# EAGLE design e-stop-radio (EAGLE 9.6.2)

## Sheet 1 of 2
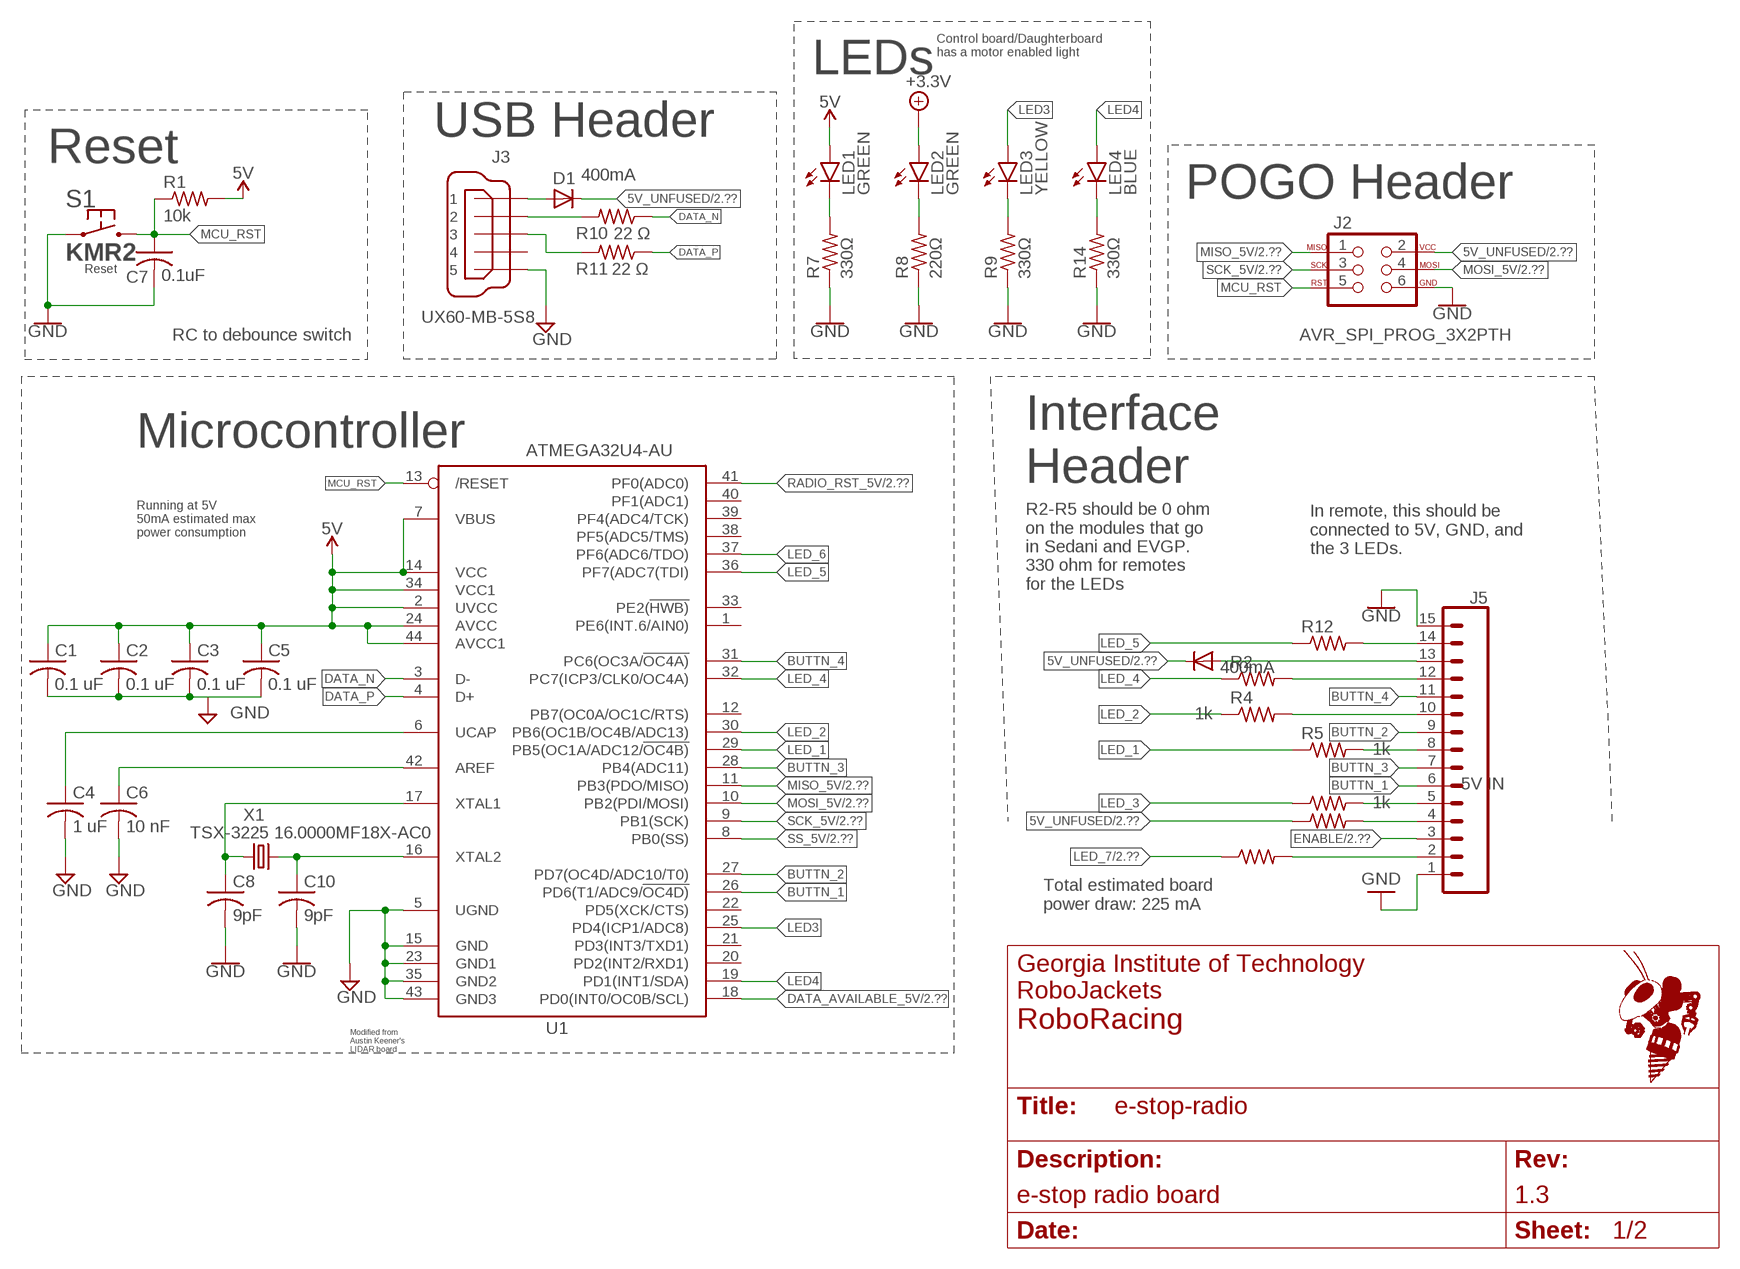
[diagram p0: schematic, sheet 1]
FRAME4 (FRAME_A_L): REVISION: 1.3; SCH_DESC: e-stop radio board; TEAM: RoboRacing

### Parts
C1  0.1 uF  C-USC0603  [C0603]
C2  0.1 uF  C-USC0603  [C0603]
C3  0.1 uF  C-USC0603  [C0603]
C4  1 uF  C-USC0603  [C0603]
C5  0.1 uF  C-USC0603  [C0603]
C6  10 nF  C-USC0603  [C0603]
C7  0.1uF  C-USC0603  [C0603]
C8  9pF  C-USC0603  [C0603]
C10  9pF  C-USC0603  [C0603]
D1  400mA  DIODE-SOD323-R  [SOD323-R]
D4  400mA  DIODE-SOD323-R  [SOD323-R]
J2  AVR_SPI_PROG_3X2PTH  [2X3]
J3  UX60-MB-5S8  [UX60-MB-5S8]
J5  CONN_15  [1X15]
LED1  GREEN  LEDCHIP-LED0603  [CHIP-LED0603]
LED2  GREEN  LEDCHIP-LED0603  [CHIP-LED0603]
LED3  YELLOW  LEDCHIP-LED0603  [CHIP-LED0603]
LED4  BLUE  LEDCHIP-LED0603  [CHIP-LED0603]
R1  10k  R-US_R0603  [R0603]
R2  330  R-US_R0603  [R0603]
R3\  1k  R-US_R0603  [R0603]
R4  1k  R-US_R0603  [R0603]
R5  1k  R-US_R0603  [R0603]
R7  330Ω  R-US_R0603  [R0603]
R8  220Ω  R-US_R0603  [R0603]
R9  330Ω  R-US_R0603  [R0603]
R10  22 Ω  R-US_R0603  [R0603]
R11  22 Ω  R-US_R0603  [R0603]
R12  330  R-US_R0603  [R0603]
R14  330Ω  R-US_R0603  [R0603]
R17  330  R-US_R0603  [R0603]
R18  330  R-US_R0603  [R0603]
S1  KMR2  [KMR2]
U1  ATMEGA32U4-AU  [TQFP44]
X1  TSX-3225 16.0000MF18X-AC0  XTAL-3.2X2.5  [XTAL-3.2X2.5]

### Nets
5V [power]: C1.1 C2.1 C3.1 C5.1 LED1.A R1.2 U1.2(UVCC) U1.7(VBUS) U1.14(VCC) U1.24(AVCC) U1.34(VCC1) U1.44(AVCC1) ; also sheet 2
5V_UNFUSED [power]: D1.C D4.C J2.2 R17.1 ; also sheet 2
+3.3V [power]: LED2.A ; also sheet 2
AREF: C6.1 U1.42(AREF)
BUTTN_1: J5.6 U1.26(PD6(T1/ADC9/!OC4D))
BUTTN_2: J5.9 U1.27(PD7(OC4D/ADC10/T0))
BUTTN_3: J5.7 U1.28(PB4(ADC11))
BUTTN_4: J5.11 U1.31(PC6(OC3A/!OC4A))
DATA_AVAILABLE_5V: U1.18(PD0(INT0/OC0B/SCL)) ; also sheet 2
DATA_N [RF]: R10.1 U1.3(D-)
DATA_P [RF]: R11.1 U1.4(D+)
DIO_4_R: J5.8 R5.2
DIO_5_R: J5.10 R4.2
DIO_6_R: J5.5 R3\.2
DIO_7_R: J5.12 R2.2
DIO_7_R1: J5.14 R12.2
DIO_7_R2: J5.4 R17.2
DIO_7_R3: J5.2 R18.2
ENABLE: J5.3 ; also sheet 2
GND [power]: C1.2 C2.2 C3.2 C4.2 C5.2 C6.2 C7.2 C8.2 C10.2 J2.6 J3.5 J5.15 R7.1 R8.1 R9.1 R14.1 S1.1.1 S1.1.2 U1.5(UGND) U1.15(GND) U1.23(GND1) U1.35(GND2) U1.43(GND3) ; also sheet 2
H4 [power]: D4.A J5.13
LED3: LED3.A U1.25(PD4(ICP1/ADC8))
LED4: LED4.A U1.19(PD1(INT1/SDA))
LED_1: R5.1 U1.29(PB5(OC1A/ADC12/!OC4B))
LED_2: R4.1 U1.30(PB6(OC1B/OC4B/ADC13))
LED_3: R3\.1
LED_4: R2.1 U1.32(PC7(ICP3/CLK0/OC4A))
LED_5: R12.1 U1.36(PF7(ADC7(TDI))
LED_6: U1.37(PF6(ADC6/TDO))
LED_7: R18.1 ; also sheet 2
MCU_RST: C7.1 J2.5 R1.1 S1.2.1 S1.2.2 U1.13(/RESET)
MISO_5V: J2.1 U1.11(PB3(PDO/MISO)) ; also sheet 2
MOSI_5V: J2.4 U1.10(PB2(PDI/MOSI)) ; also sheet 2
N$2: LED3.C R9.2
N$3: LED1.C R7.2
N$4: LED2.C R8.2
N$5: J3.2 R10.2
N$6: LED4.C R14.2
N$7: D1.A J3.1
N$11: J3.3 R11.2
N$15: J5.1 ; supply symbol labelled GND
RADIO_RST_5V: U1.41(PF0(ADC0)) ; also sheet 2
SCK_5V: J2.3 U1.9(PB1(SCK)) ; also sheet 2
SS_5V: U1.8(PB0(SS)) ; also sheet 2
UCAP: C4.1 U1.6(UCAP)
XTAL1: C8.1 U1.17(XTAL1) X1.1
XTAL2: C10.1 U1.16(XTAL2) X1.3
Unconnected: J3.4 U1.1(PE6(INT.6/AIN0)) U1.12(PB7(OC0A/OC1C/RTS)) U1.20(PD2(INT2/RXD1)) U1.21(PD3(INT3/TXD1)) U1.22(PD5(XCK/CTS)) U1.33(PE2(!HWB)) U1.38(PF5(ADC5/TMS)) U1.39(PF4(ADC4/TCK)) U1.40(PF1(ADC1))

### Notes on the sheet
- Control board/Daughterboard
  has a motor enabled light
- LEDs
- USB Header
- Reset
- POGO Header
- RC to debounce switch
- Microcontroller
- Interface
  Header
- Running at 5V
  50mA estimated max
  power consumption
- In remote, this should be 
  connected to 5V, GND, and 
  the 3 LEDs.
- R2-R5 should be 0 ohm
  on the modules that go
  in Sedani and EVGP.
  330 ohm for remotes
  for the LEDs
- 5V IN
- Total estimated board
  power draw: 225 mA
- Modified from 
  Austin Keener's 
  LIDAR board

## Sheet 2 of 2
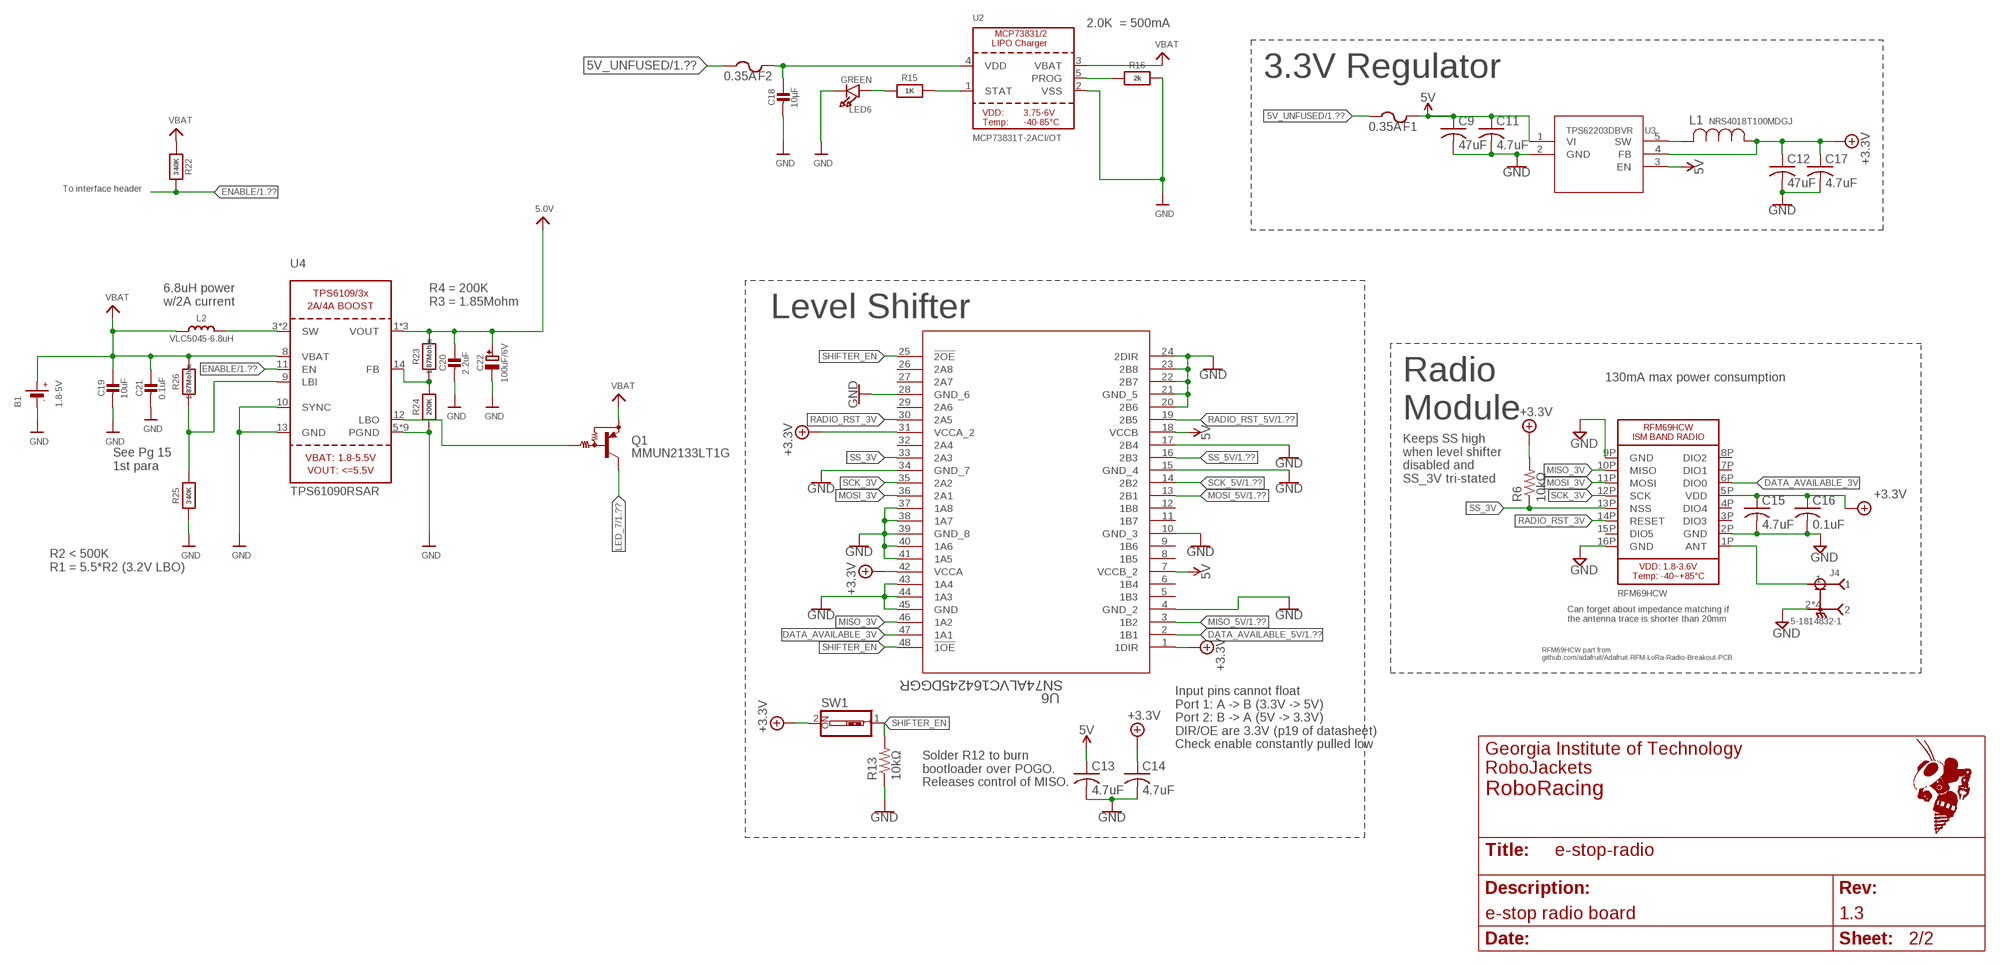
[diagram p1: schematic, sheet 2]
FRAME3 (FRAME_A_L): REVISION: 1.3; SCH_DESC: e-stop radio board; TEAM: RoboRacing

### Parts
B1  1.8-5V  BATTERY  [JSTPH2]
C9  47uF  C-USC1206  [C1206]
C11  4.7uF  C-USC0603  [C0603]
C12  47uF  C-USC1206  [C1206]
C13  4.7uF  C-USC0603  [C0603]
C14  4.7uF  C-USC0603  [C0603]
C15  4.7uF  C-USC0603  [C0603]
C16  0.1uF  C-USC0603  [C0603]
C17  4.7uF  C-USC0603  [C0603]
C18  10µF  CAP_CERAMIC0805-NOOUTLINE  [0805-NO]
C19  10uF  CAP_CERAMIC0805-NOOUTLINE  [0805-NO]
C20  2.2uF  CAP_CERAMIC0805-NOOUTLINE  [0805-NO]
C21  0.1uF  CAP_CERAMIC0805-NOOUTLINE  [0805-NO]
C22  100uF/6V  CAP_TANTALUMB/3528_REFLOW  [EIA3528-21/B-R]
F1  0.35A  PTCFUSE-1206  [R1206]
F2  0.35A  PTCFUSE-1206  [R1206]
J4  5-1814832-1  [TE_5-1814832-1]
L1  NRS4018T100MDGJ  [IND_TAIYO_NRS4018]
L2  VLC5045-6.8uH  INDUCTORTDK_VLC5045  [INDUCTOR_5X5MM_TDK_VLC5045]
LED6  GREEN  LED0805_NOOUTLINE  [CHIPLED_0805_NOOUTLINE]
Q1  MMUN2133LT1G  MUN2114T1-PNP_DRIVER-SC59-BEC  [SC59-BEC]
R6  10kΩ  R-US_R0603  [R0603]
R13  10kΩ  R-US_R0603  [R0603]
R15  1K  RESISTOR0805_NOOUTLINE  [0805-NO]
R16  2k  RESISTOR0805_NOOUTLINE  [0805-NO]
R22  340K  RESISTOR0805_NOOUTLINE  [0805-NO]
R23  1.87Mohm  RESISTOR0805_NOOUTLINE  [0805-NO]
R24  200K  RESISTOR0805_NOOUTLINE  [0805-NO]
R25  340K  RESISTOR0805_NOOUTLINE  [0805-NO]
R26  1.87Mohm  RESISTOR0805_NOOUTLINE  [0805-NO]
SW1  SW_DIP-1  [EDG-01]
U2  MCP73831T-2ACI/OT  MCP73831/2  [SOT23-5]
U3  TPS62203DBVR  [DBV5]
U4  TPS61090RSAR  VREG_TPS6103X  [PVQFN-16]
U5  RFM69HCW  RFM69HCW_SMT  [RFMHCW_SMT]
U6  SN74ALVC164245DGGR  [DGG48]

### Nets
5V [power]: C9.1 C11.1 C13.1 C20.1 C22.+ F1.2 R23.2 U3.1(VI) U3.3(EN) U4.1(VOUT) U4.15(VOUT) U4.16(VOUT) U6.7(VCCB_2) U6.18(VCCB) ; supply symbol labelled 5.0V ; also sheet 1
5V_UNFUSED [power]: F1.1 F2.1 ; also sheet 1
+3.3V [power]: C12.1 C14.1 C15.1 C16.1 C17.1 L1.1 R6.2 SW1.2 U3.4(FB) U5.5P(VDD) U6.1(1DIR) U6.31(VCCA_2) U6.42(VCCA) ; also sheet 1
CHARGER [power]: C18.1 F2.2 U2.4(VDD)
DATA_AVAILABLE_3V: U5.6P(DIO0) U6.47(1A1)
DATA_AVAILABLE_5V: U6.2(1B1) ; also sheet 1
ENABLE: R22.2 U4.11(EN) ; also sheet 1
GND [power]: B1.1(-) C9.2 C11.2 C12.2 C13.2 C14.2 C15.2 C16.2 C17.2 C18.2 C19.2 C20.2 C21.2 C22.- J4.2 J4.3 J4.4 J4.5 LED6.C R13.1 R16.2 R24.1 R25.1 U2.2(VSS) U3.2(GND) U4.5(PGND) U4.6(PGND) U4.7(PGND) U4.10(SYNC) U4.13(GND) U4.P$18(PGND) U4.P$19(PGND) U4.P$20(PGND) U4.P$21(PGND) U4.P$22(PGND) U4.THERMAL(PGND) U5.2P(GND) U5.9P(GND) U5.16P(GND) U6.4(GND_2) U6.10(GND_3) U6.15(GND_4) U6.17(2B4) U6.20(2B6) U6.21(GND_5) U6.22(2B7) U6.23(2B8) U6.24(2DIR) U6.28(GND_6) U6.34(GND_7) U6.37(1A8) U6.38(1A7) U6.39(GND_8) U6.40(1A6) U6.41(1A5) U6.43(1A4) U6.44(1A3) U6.45(GND) ; also sheet 1
LBO: Q1.B U4.12(LBO)
LED_7: Q1.C ; also sheet 1
MISO_3V: U5.10P(MISO) U6.46(1A2)
MISO_5V: U6.3(1B2) ; also sheet 1
MOSI_3V: U5.11P(MOSI) U6.36(2A1)
MOSI_5V: U6.13(2B1) ; also sheet 1
N$1 [power]: L1.2 U3.5(SW)
N$8: R15.2 U2.1(STAT)
N$10: R16.1 U2.5(PROG)
N$12: LED6.A R15.1
N$13: L2.P$2 U4.3(SW) U4.4(SW)
N$14: R25.2 R26.1 U4.9(LBI)
N$16: R23.1 R24.2 U4.14(FB)
RADIO_RST_3V: U5.14P(RESET) U6.30(2A5)
RADIO_RST_5V: U6.19(2B5) ; also sheet 1
RF_SIGNAL [RF]: J4.1 U5.1P(ANT)
SCK_3V: U5.12P(SCK) U6.35(2A2)
SCK_5V: U6.14(2B2) ; also sheet 1
SHIFTER_EN: R13.2 SW1.1 U6.25(!2OE) U6.48(!1OE)
SS_3V: R6.1 U5.13P(NSS) U6.33(2A3)
SS_5V: U6.16(2B3) ; also sheet 1
VBAT: B1.2(+) C19.1 C21.1 L2.P$1 Q1.E R22.1 R26.2 U2.3(VBAT) U4.8(VBAT)
Unconnected: U5.3P(DIO3) U5.4P(DIO4) U5.7P(DIO1) U5.8P(DIO2) U5.15P(DIO5) U6.5(1B3) U6.6(1B4) U6.8(1B5) U6.9(1B6) U6.11(1B7) U6.12(1B8) U6.26(2A8) U6.27(2A7) U6.29(2A6) U6.32(2A4)

### Notes on the sheet
- 2.0K  = 500mA
- 3.3V Regulator
- To interface header
- 6.8uH power
  w/2A current
- R4 = 200K
  R3 = 1.85Mohm
- Level Shifter
- 130mA max power consumption
- Radio
  Module
- See Pg 15
  1st para
- Keeps SS high
  when level shifter
  disabled and
  SS_3V tri-stated
- R2 < 500K
  R1 = 5.5*R2 (3.2V LBO)
- Can forget about impedance matching if 
  the antenna trace is shorter than 20mm
- RFM69HCW part from
  github.com/adafruit/Adafruit-RFM-LoRa-Radio-Breakout-PCB
- Input pins cannot float
  Port 1: A -> B (3.3V -> 5V)
  Port 2: B -> A (5V -> 3.3V)
  DIR/OE are 3.3V (p19 of datasheet)
  Check enable constantly pulled low
- Solder R12 to burn
  bootloader over POGO.
  Releases control of MISO.

## Library data of the parts
B1 = microbuilder:BATTERY: CR1220 SMT - Digikey: 3001K-ND CD2032 BAT-HLD-001 - Digikey: BAT-HLD-001-ND
C1-C6 C8 C10 = resistor:C-US: CAPACITOR, American symbol
C7 C9 C11-C17 = rcl:C-US: CAPACITOR, American symbol; SPICEPREFIX: C
C18-C21 = microbuilder:CAP_CERAMIC: Ceramic Capacitors For new designs, use the packages preceded by an '_' character since they are more reliable: The following footprints should be used on most boards: _0402 - Standard footprint for regular board layouts _0603 - Standard footprint for regular board layouts _0805 - Standard footprint for regular board layouts _1206 - Standard footprint for regular board layouts For extremely tight-pitch boards where space is at a premium, the following 'micro-pitch' footprints can be used (smaller pads, no silkscreen outline, etc.): _0402MP - Micro-pitch footprint for very dense/compact boards _0603MP - Micro-pitch footprint for very dense/compact boards _0805MP - Micro-pitch footprint for very dense/compact boards _1206MP - Micro-pitch footprint for very dense/compact boards
C22 = microbuilder:CAP_TANTALUM: Tantalum Capacitors Wave footprints have larger pads and are meant to be used for hand soldering. Reflow footprints are optimised for solder paste and a reflow oven. EIA3216-18/A-[R/W] - Size A / 3216-18 / 1206 footprint 4.7µF 25V 10% Tantalum Capacitor 10µF 16V 10% Tantalum Capacitor [Digikey: 495-2236-2-ND] EIA3528-21/B-[R/W] - Size B / 3528-21 47µF 10V 10% Tantalum Capactior [Digikey: 495-2216-1-ND] EIA6032-28/C-[R/W] - Size C / 6032-28 10µF 35V 20% Tantalum Capacitor [Digikey: 495-2285-1-ND] 100µF 16V 10% Tantalum Capactior [Digikey: 399-5214-1-ND]
D1 D4 = RoboJackets-Diodes:DIODE-: DIODE
F1 F2 = adafruit:PTCFUSE: PTC fuses, resettable thermistors
J2 = SparkFun-Connectors:AVR_SPI_PROG_3X2: AVR ISP 6 Pin This is the reduced ISP connector for AVR programming. Common on Arduino. This footprint will take up less PCB space and can be used with a 10-pin to 6-pin adapter such as SKU: BOB-08508 **Special note about "TEST_POINT" package. The stop mask is on the top side, so if you want your programming test points to be on the bottom of your board, make sure to place this package on the bottom side of the board. This also ensure that the orientation to program from the bottom side will be correct. SparkFun Products: SparkFun ISP Pogo Adapter <https://www.sparkfun.com/products/11591> - NS Tiny AVR Programmer <https://www.sparkfun.com/products/11801> -PTH
J3 = RoboJackets-Connectors:UX60*-MB-5S?: Mini USB Connector Brand: Hirose Electric Co Ltd <http://www.hirose.com/us/> Series: UX <http://www.digikey.com/product-search/en?FV=fff40016,fff802e4,ffec3225> Distributor: Digi-Key <http://www.digikey.com/product-detail/en/UX60A-MB-5ST/H2961CT-ND/597540>; PINS: 5
J4 = estop-v1.0:5-1814832-1: SMA Str PCB Skt GZD; COMMENT: 5-1814832-1; DESCRIPTION: SMA Str PCB Skt GZD; DIGI-KEY_PART_NUMBER: A97594-ND; DIGI-KEY_PURCHASE_URL: https://www.digikey.com/product-detail/en/te-connectivity-amp-connectors/5-1814832-1/A97594-ND/1755982?utm_source=snapeda&utm_medium=aggregator&utm_campaign=symbol; EU_ROHS_COMPLIANCE: Compliant with Exemptions; MF: TE Connectivity; MP: 5-1814832-1; NUMBER_OF_POSITIONS: 1; PACKAGE: None; TE_PURCHASE_URL: https://www.te.com/usa-en/product-5-1814832-1.html?te_bu=Cor&te_type=disp&te_campaign=seda_glo_cor-seda-global-disp-prtnr-fy19-seda-model-bom-cta_sma-317_1&elqCampaignId=32493
J5 = SparkFun-Connectors:CONN_15: Multi connection point. Often used as Generic Header-pin footprint for 0.1 inch spaced/style header connections On any of the 0.1 inch spaced packages, you can populate with these: Break Away Headers - Straight <https://www.sparkfun.com/products/116> (PRT-00116) Break Away Male Headers - Right Angle <https://www.sparkfun.com/products/553> (PRT-00553) Female Headers <https://www.sparkfun.com/products/115> (PRT-00115) Break Away Headers - Machine Pin <https://www.sparkfun.com/products/117> (PRT-00117) Break Away Female Headers - Swiss Machine Pin <https://www.sparkfun.com/products/743> (PRT-00743) For SCREWTERMINALS and SPRING TERMINALS visit here: Screw Terimnals on SparkFun.com <https://www.sparkfun.com/search/results?term=Screw+Terminals> (5mm/3.5mm/2.54mm spacing) This device is also useful as a general connection point to wire up your design to another part of your project. Our various solder wires solder well into these plated through hole pads. Hook-Up Wire - Assortment (Stranded, 22 AWG) <https://www.sparkfun.com/products/11375> (PRT-11375) Hook-Up Wire - Assortment (Solid Core, 22 AWG) <https://www.sparkfun.com/products/11367> (PRT-11367) View the entire wire category on our website here <https://www.sparkfun.com/categories/141> Special notes: Molex polarized connector foot print use with SKU : PRT-08231 with associated crimp pins and housings. 1MM SMD Version SKU: PRT-10208 NOTES ON THE VARIANTS LOCK and LOCK_LONGPADS... This footprint was designed to help hold the alignment of a through-hole component (i.e. 6-pin header) while soldering it into place. You may notice that each hole has been shifted either up or down by 0.005 of an inch from it's more standard position (which is a perfectly straight line). This slight alteration caused the pins (the squares in the middle) to touch the edges of the holes. Because they are alternating, it causes a "brace" to hold the component in place. 0.005 has proven to be the perfect amount of "off-center" position when using our standard breakaway headers. Although looks a little odd when you look at the bare footprint, once you have a header in there, the alteration is very hard to notice. Also,if you push a header all the way into place, it is covered up entirely on the bottom side.
L1 = estop-v1.0:NRS4018T100MDGJ; MANUFACTURER_PART_NUMBER: NRS4018T100MDGJ; VENDOR: TAIYO YUDEN
L2 = microbuilder:INDUCTOR: Inductors 0603: 10nH Ceramic Inductor - microwire antenna/RF (Digikey: 712-1434-2-ND) 0805: 560nH Ceramic Inductor - RF (Digikey: 553-1047-1-ND) 270nH Ceramic Inductor - Q = 40@250MHz, +-5%, 1 Ohm DC Resistance (Digikey: 535-10506-2-ND) 1007 (2518 Metric) SMT: 10µH 10% 250mOhm 820mA 1007 Inductor (Digikey: 587-2189-1-ND) 22µH 10% 500mOhm 580mA 1007 Inductor (Digikey: 587-2190-1-ND) 47µH 10% 950mOhm 420mA 1007 Inductor (Digikey: 587-2191-1-ND) 47µH 5% 100mOhm 1A 1008 Inductor (Digikey: 732-1816-1-ND) 5.0x5.0mm (Taiyo Yuden NR5040 Series) 6.8µH 20% 2.3A 64mOhm Inductor (Digikey: 587-2374-2-ND) 5.0x5.0mm (TDK VLC5045 Series) 4.7µH 20% 3.3A 34mOhm Inductor (Digikey: 445-6526-1-ND) 6.8µH 20% 2.7A 46mOhm Inductor (Digikey: 445-6527-1-ND) 6.0x6.0mm (TDK VLC6045 Series) 4.7µH 20% 3.8A 27mOhm Inductor (Digikey: 445-6538-2-ND) 6.8µH 20% 3A 41mOhm Inductor (Digikey: 445-6540-1-ND) 6.2µH 30% 2.2A 45mOhm Inductor (Digikey: SRR5028-6R2YCT-ND) - Not TDK VLC6045 but footprint should match 6.0x6.0mm (TDK SLF6045 Series) 6.8uH 30% 2A 33mOhm Inductor (Digikey: 445-4572-1-ND, Mouser: 810-SLF645T6R8N2R0PF) 6.0x6.0mm (Sumida CDRH5D28 Series) 6.2uH 30% 1.8A 45mOhm Inductor (Digikey: 308-1542-1-ND) Taiyo Yuden NR3015T2R2M - 2.2uH 20% 1.5A (Digikey: 587-1648-2-ND, Mouser: 963-NR3015T2R2M) - Used with TI TPS62172 CoilCraft RFID Transponder Coil - MA5532-AE (For use with AS3935 Lightning Sensor)
LED1-LED4 = led:LED: LED
LED6 = microbuilder:LED: LED
Q1 = transistor:*-PNP_DRIVER-: PNP Bias Resistor Transistor
R1 R2 R3\ R4-R14 R17 R18 = rcl:R-US_: RESISTOR, American symbol; SPICEPREFIX: R
R15 R16 R22-R26 = microbuilder:RESISTOR: Resistors For new designs, use the packages preceded by an '_' character since they are more reliable: The following footprints should be used on most boards: _0402 - Standard footprint for regular board layouts _0603 - Standard footprint for regular board layouts _0805 - Standard footprint for regular board layouts _1206 - Standard footprint for regular board layouts For extremely tight-pitch boards where space is at a premium, the following 'micro-pitch' footprints can be used (smaller pads, no silkscreen outline, etc.): _0402MP - Micro-pitch footprint for very dense/compact boards _0603MP - Micro-pitch footprint for very dense/compact boards _0805MP - Micro-pitch footprint for very dense/compact boards _1206MP - Micro-pitch footprint for very dense/compact boards
S1 = RoboJackets-Switches:KMR2; FUNCTION: Reset
SW1 = special:SW_DIP-1: DIP SWITCH
U1 = estop-v1.0:ATMEGA32U4: http://www.ladyada.net/library/eagle
U2 = microbuilder:MCP73831/2: MCP73831/2 LIPO Charger VDD: 3.75 - 6V Temp -40 - 85°C Programmable Charge Rate: 15-500mA NOTE: STAT is a tri-state logic output on the MCP73831 and an open-drain output on the MCP73832. SOT23-5 with 4.2V output and tri-state logic on STAT = MCP73831T-2ACI/OT
U3 = estop-v1.0:TPS62203DBVR; MANUFACTURER_PART_NUMBER: TPS62203DBVR; VENDOR: Texas Instruments
U4 = microbuilder:VREG_TPS6103X: TPS6103x 4A Boost - 1.8-5.5V Input, Adjustable Output to 5.5V
U5 = estop-v1.0:RFM69HCW: RFM69HCW - ISM Band RF Transceiver
U6 = estop-v1.0:SN74ALVC164245DGGR; MANUFACTURER_PART_NUMBER: SN74ALVC164245DGGR; VENDOR: Texas Instruments
X1 = RoboJackets-FreqGen:XTAL

## Net classes
0 default: width 0.203 mm, drill 0.508 mm, clearance 0.178 mm
1 power: width 0.305 mm, drill 0.508 mm, clearance 0.178 mm
2 RF: width 0.203 mm, clearance 0.178 mm

## Board
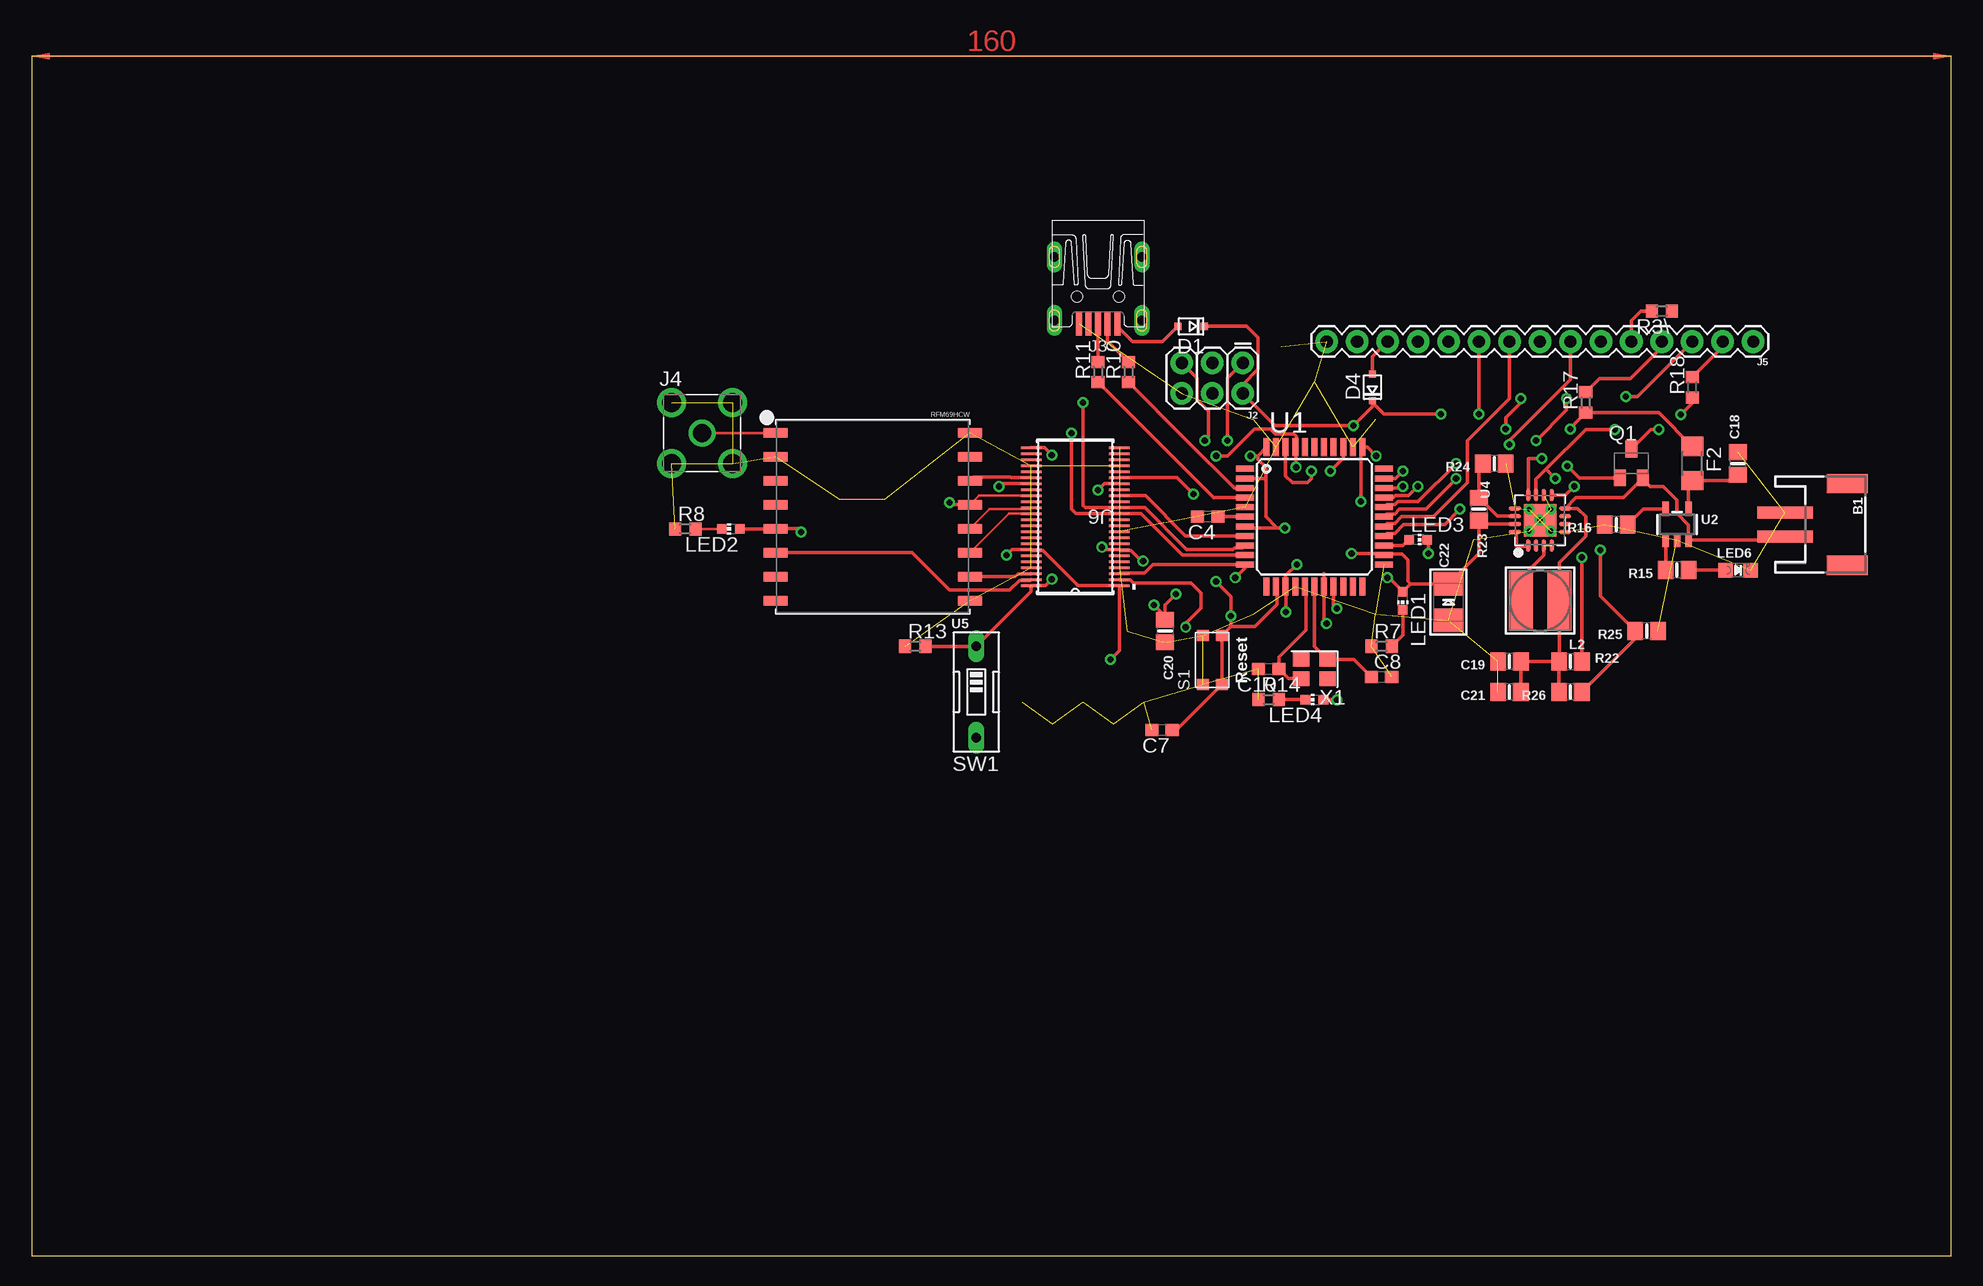
[diagram p2: board, top side]
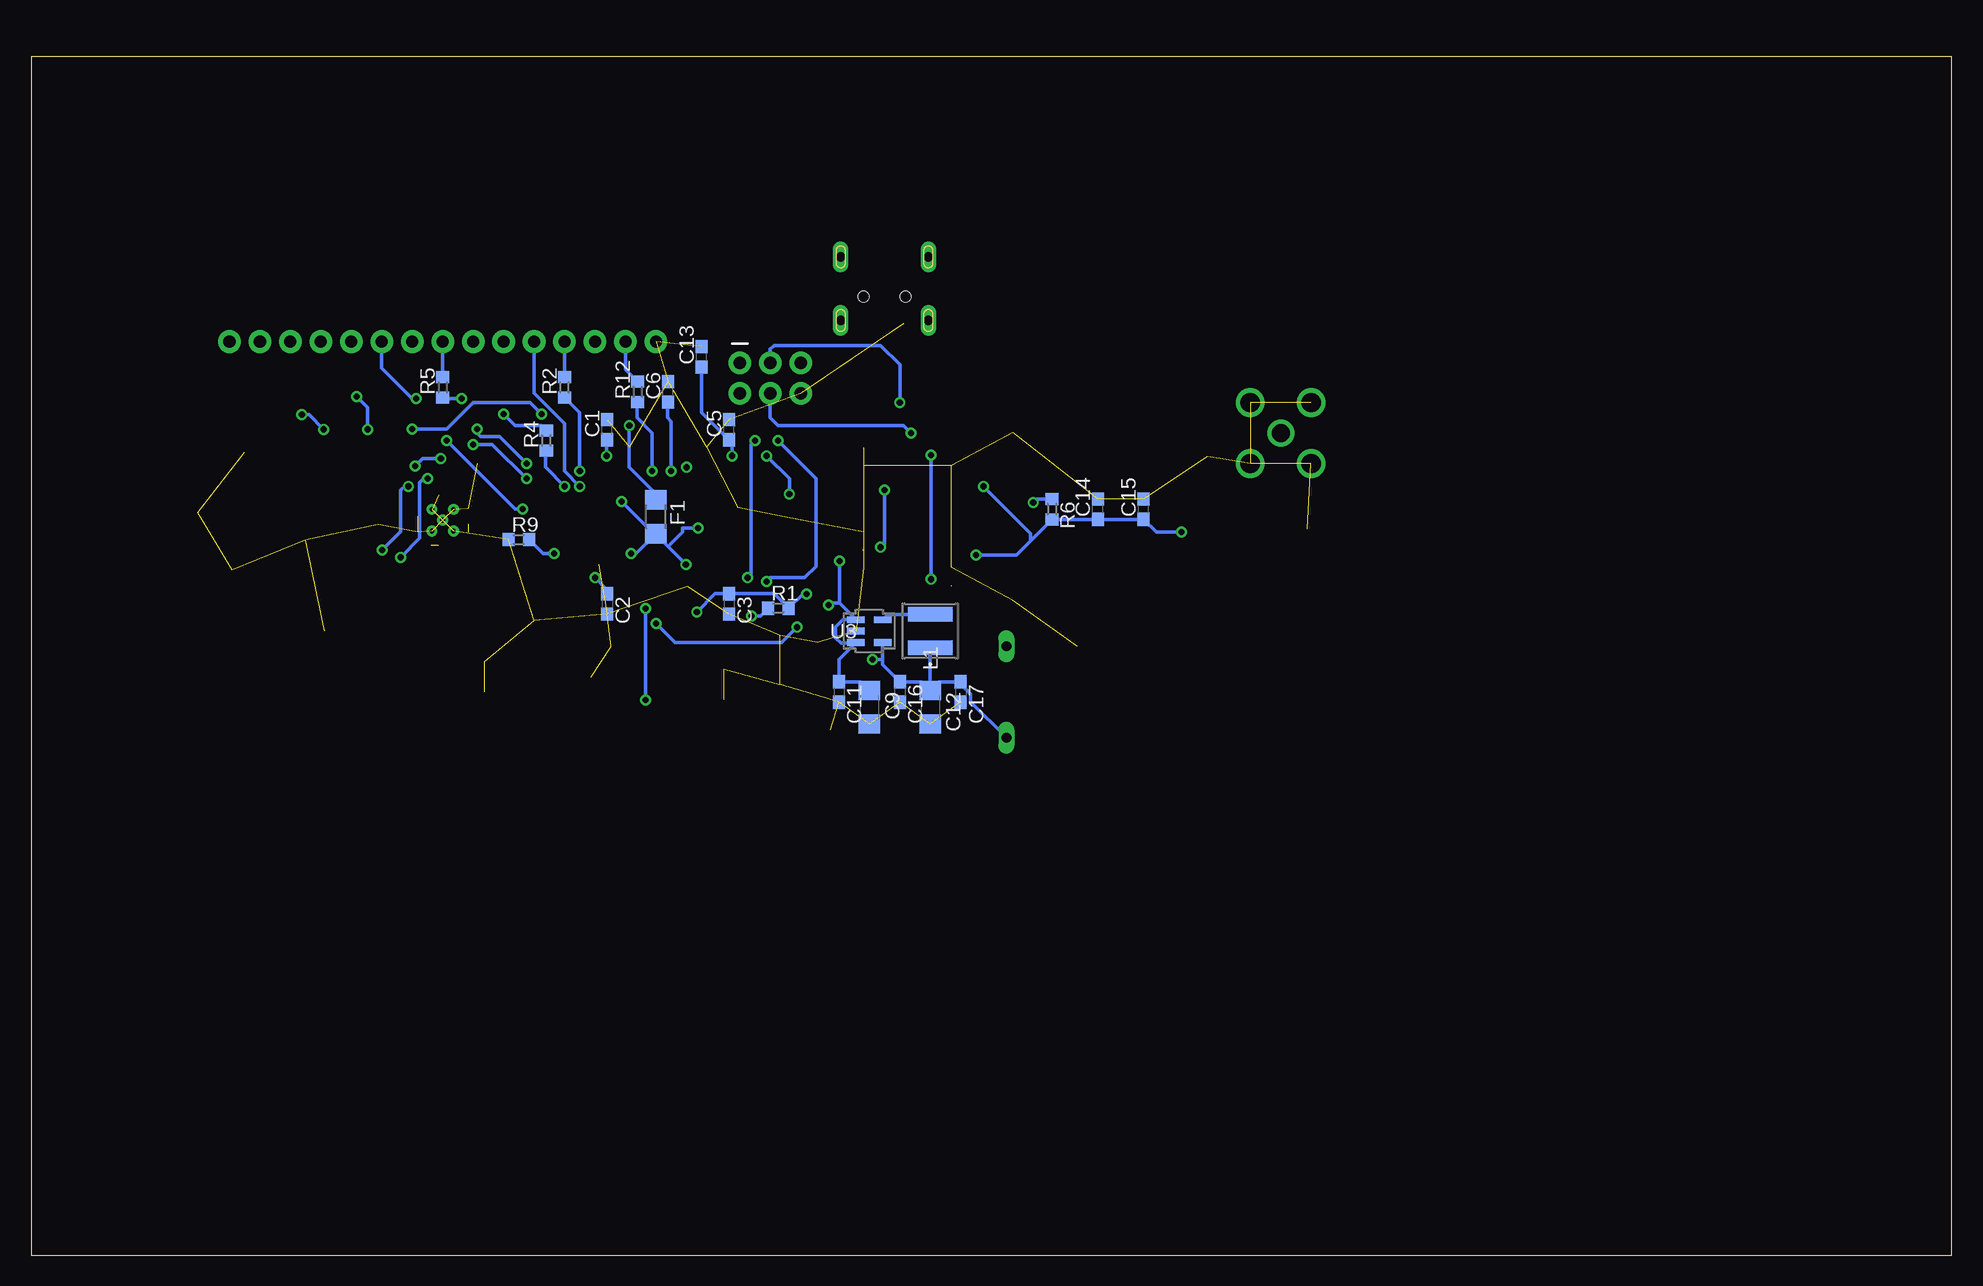
[diagram p3: board, bottom side, seen from below]

Size 160 x 100 mm. Coordinates in mm from the lower left corner, seen from the top.
Outline: 0,0 160,0 160,100 0,100 0,0
Copper layers (1*16): Top 0.035mm / dielectric 1.5mm / Bottom 0.035mm
Design rules "default": minimum track width 6mil, minimum drill 0.35mm, track to track 6mil, track to pad 6mil, pad to pad 6mil, via to via 6mil, smd to smd 6mil, copper to edge 40mil, drill to drill 6mil, minimum pad ring 10mil, minimum via ring 8mil, stop-mask expansion 4mil, vias tented up to drill 0mil, thermal gap 10mil

### Footprints (pad centres in the part's own frame; a part is rotated, then mirrored left to right if it is on the bottom)
JSTPH2 = smd 1 x 4.6: 1 -1,-3.7; 2 1,-3.7 | smd 1.6 x 3.4: NC1 -3.4,1.5; NC2 3.4,1.5
C0603 = smd 1.1 x 1: 1 -0.85,0; 2 0.85,0
C1206 = smd 1.6 x 1.8: 1 -1.4,0; 2 1.4,0
0805-NO = smd 1.3 x 1.5: 1 -0.95,0; 2 0.95,0
EIA3528-21/B-R = smd 1.95 x 2.5: + 1.525,0; - -1.525,0
SOD323-R = smd 0.6 x 0.6: A 1.1,0; C -1.1,0
R1206 = smd 1.6 x 1.803: 1 -1.422,0; 2 1.422,0
2X3 = drill 1.016 pad 1.88: 1 0,0; 2 0,2.54; 3 2.54,0; 4 2.54,2.54; 5 5.08,0; 6 5.08,2.54
UX60-MB-5S8 = smd 2 x 0.5: 1 8.65,1.6; 2 8.65,0.8; 3 8.65,0; 4 8.65,-0.8; 5 8.65,-1.6 | drill 0.8 long: M1 3.1,-3.65; M2 3.1,3.65; M3 8.4,3.65; M4 8.4,-3.65 | hole 0.9: 6.4,-1.75; 6.4,1.75
TE_5-1814832-1 = drill 1.5: 1 0,0 | drill 1.6: 2 -2.54,2.54; 3 2.54,2.54; 4 -2.54,-2.54; 5 2.54,-2.54
1X15 = drill 1.016 pad 1.88: 1 0,0; 2 2.54,0; 3 5.08,0; 4 7.62,0; 5 10.16,0; 6 12.7,0; 7 15.24,0; 8 17.78,0; 9 20.32,0; 10 22.86,0; 11 25.4,0; 12 27.94,0; 13 30.48,0; 14 33.02,0; 15 35.56,0
IND_TAIYO_NRS4018 = smd 1.194 x 3.708: 1 -1.397,0; 2 1.397,0
INDUCTOR_5X5MM_TDK_VLC5045 = smd 2 x 5: P$1 -1.6,0; P$2 1.6,0
CHIP-LED0603 = smd 0.8 x 0.8: A 0,-0.75; C 0,0.75
CHIPLED_0805_NOOUTLINE = smd 1.2 x 1.2: A 0,-1.05; C 0,1.05
SC59-BEC = smd 1 x 1.4: B -0.95,-1.2; C 0,1.2; E 0.95,-1.2
R0603 = smd 1 x 1.1: 1 -0.85,0; 2 0.85,0
KMR2 = smd 0.9 x 1: 1.1 -2.05,0.8; 1.2 2.05,0.8; 2.1 -2.05,-0.8; 2.2 2.05,-0.8
EDG-01 = drill 0.813 long: 1 0,-3.81; 2 0,3.81
TQFP44 = smd 1.5 x 0.5: 1 -5.8,4; 2 -5.8,3.2; 3 -5.8,2.4; 4 -5.8,1.6; 5 -5.8,0.8; 6 -5.8,0; 7 -5.8,-0.8; 8 -5.8,-1.6; 9 -5.8,-2.4; 10 -5.8,-3.2; 11 -5.8,-4; 23 5.8,-4; 24 5.8,-3.2; 25 5.8,-2.4; 26 5.8,-1.6; 27 5.8,-0.8; 28 5.8,0; 29 5.8,0.8; 30 5.8,1.6; 31 5.8,2.4; 32 5.8,3.2; 33 5.8,4 | smd 0.5 x 1.5: 12 -4,-5.8; 13 -3.2,-5.8; 14 -2.4,-5.8; 15 -1.6,-5.8; 16 -0.8,-5.8; 17 0,-5.8; 18 0.8,-5.8; 19 1.6,-5.8; 20 2.4,-5.8; 21 3.2,-5.8; 22 4,-5.8; 34 4,5.8; 35 3.2,5.8; 36 2.4,5.8; 37 1.6,5.8; 38 0.8,5.8; 39 0,5.8; 40 -0.8,5.8; 41 -1.6,5.8; 42 -2.4,5.8; 43 -3.2,5.8; 44 -4,5.8
SOT23-5 = smd 0.55 x 1.2: 1 -0.95,-1.3; 2 0,-1.3; 3 0.95,-1.3; 4 0.95,1.3; 5 -0.95,1.3
DBV5 = smd 1.473 x 0.559: 1 -1.118,0.95; 2 -1.118,0; 3 -1.118,-0.95; 4 1.118,-0.95; 5 1.118,0.95
PVQFN-16 = smd 1.05 x 0.35: 1 -2.1,0.975; 2 -2.1,0.325; 3 -2.1,-0.325; 4 -2.1,-0.975; 9 2.1,-0.975; 10 2.1,-0.325; 11 2.1,0.325; 12 2.1,0.975 | smd 0.35 x 1.05: 5 -0.975,-2.1; 6 -0.325,-2.1; 7 0.325,-2.1; 8 0.975,-2.1; 13 0.975,2.1; 14 0.325,2.1; 15 -0.325,2.1; 16 -0.975,2.1 | drill 0.4: P$18 0,0; P$19 -0.9,0.9; P$20 0.9,0.9; P$21 0.9,-0.9; P$22 -0.9,-0.9 | smd 2.7 x 2.7: THERMAL 0,0
RFMHCW_SMT = smd 2 x 0.8: 1P 8.1,-7; 2P 8.1,-5; 3P 8.1,-3; 4P 8.1,-1; 5P 8.1,1; 6P 8.1,3; 7P 8.1,5; 8P 8.1,7; 9P -8.1,7; 10P -8.1,5; 11P -8.1,3; 12P -8.1,1; 13P -8.1,-1; 14P -8.1,-3; 15P -8.1,-5; 16P -8.1,-7
DGG48 = smd 1.676 x 0.229: 1 -3.67,5.75; 2 -3.67,5.25; 3 -3.67,4.75; 4 -3.67,4.25; 5 -3.67,3.75; 6 -3.67,3.25; 7 -3.67,2.75; 8 -3.67,2.25; 9 -3.67,1.75; 10 -3.67,1.25; 11 -3.67,0.75; 12 -3.67,0.25; 13 -3.67,-0.25; 14 -3.67,-0.75; 15 -3.67,-1.25; 16 -3.67,-1.75; 17 -3.67,-2.25; 18 -3.67,-2.75; 19 -3.67,-3.25; 20 -3.67,-3.75; 21 -3.67,-4.25; 22 -3.67,-4.75; 23 -3.67,-5.25; 24 -3.67,-5.75; 25 3.67,-5.75; 26 3.67,-5.25; 27 3.67,-4.75; 28 3.67,-4.25; 29 3.67,-3.75; 30 3.67,-3.25; 31 3.67,-2.75; 32 3.67,-2.25; 33 3.67,-1.75; 34 3.67,-1.25; 35 3.67,-0.75; 36 3.67,-0.25; 37 3.67,0.25; 38 3.67,0.75; 39 3.67,1.25; 40 3.67,1.75; 41 3.67,2.25; 42 3.67,2.75; 43 3.67,3.25; 44 3.67,3.75; 45 3.67,4.25; 46 3.67,4.75; 47 3.67,5.25; 48 3.67,5.75
XTAL-3.2X2.5 = smd 1.4 x 1.2: 1 -1.1,-0.8; 2 1.1,-0.8; 3 1.1,0.8; 4 -1.1,0.8

### Placement (x,y rotation side)
B1  149.86,60.96 270 top
C1  112.01,68.86 90 bottom
C2  112.01,54.33 270 bottom
C3  101.85,54.33 270 bottom
C4  98.04,61.59 180 top
C5  101.85,68.86 90 bottom
C6  106.93,72.01 90 bottom
C7  94.23,43.81 180 top
C8  112.52,48.26 0 top
C9  90.17,45.72 270 bottom
C10  103.12,48.9 180 top
C11  92.71,46.99 270 bottom
C12  85.09,45.72 270 bottom
C13  104.14,74.93 90 bottom
C14  71.12,62.23 90 bottom
C15  67.31,62.23 90 bottom
C16  87.63,46.99 270 bottom
C17  82.55,46.99 270 bottom
C18  142.24,66.04 90 top
C19  123.19,49.53 180 top
C20  94.49,52.07 270 top
C21  123.19,46.99 180 top
C22  118.11,54.48 90 top
D1  96.65,77.47 180 top
D4  111.76,72.39 90 top
F1  107.95,61.59 270 bottom
F2  138.43,66.04 270 top
J2  100.97,74.42 180 top
J3  88.9,86.36 270 top
J4  55.88,68.58 0 top
J5  143.51,76.2 180 top
L1  85.09,52.07 90 bottom
L2  125.73,54.61 180 top
LED1  114.3,54.61 180 top
LED2  58.29,60.58 90 top
LED3  115.57,59.69 270 top
LED4  106.93,46.35 90 top
LED6  142.24,57.15 270 top
Q1  133.35,66.04 0 top
R1  97.74,53.98 0 bottom
R2  115.57,72.39 90 bottom
R3\  135.89,78.74 180 top
R4  117.09,67.94 90 bottom
R5  125.73,72.39 90 bottom
R6  74.93,62.23 270 bottom
R7  112.52,50.8 0 top
R8  54.48,60.58 0 top
R9  119.38,59.69 0 bottom
R10  91.44,73.66 90 top
R11  88.9,73.66 90 top
R12  109.47,72.01 90 bottom
R13  73.66,50.8 0 top
R14  103.12,46.35 0 top
R15  137.16,57.15 180 top
R16  132.08,60.96 180 top
R17  129.54,71.12 90 top
R18  138.43,72.39 90 top
R22  128.27,49.53 0 top
R23  120.65,62.23 270 top
R24  121.92,66.04 180 top
R25  134.62,52.07 180 top
R26  128.27,46.99 180 top
S1  98.42,49.66 90 top
SW1  78.74,46.99 180 top
U1  106.93,61.59 0 top
U2  137.16,60.96 0 top
U3  90.17,52.07 0 bottom
U4  125.73,61.32 90 top
U5  70.1,61.59 180 top
U6  87,61.59 180 top
X1  106.93,48.9 180 top

### Tracks (layer width: path | path; a pad name or v marks a point on that pad's centre or on a via)
5V  (via drill 0.51)  (2 unrouted)
  Top 0.305: 114.95,56.01 C22.+ 120.65,58.55 R23.2 | 114.95,56.01 LED1.A 113.14,56.52 v113.03,56.52 | R23.2 120.93,61.56 | 90.72,58.79 91.64,58.79 92.52,57.91 v92.66,57.91 | v93.57,54.25 94.49,53.34 C20.1 94.49,54.25 v95.4,55.17 | 114.95,56.01 114.73,56.23 114.73,57.98 114.23,58.48 112.82,58.48 U1.24 112.61,58.52 v110.03,58.52 | v105.46,57.61 104.53,56.68 U1.14 104.55,55.78 v104.55,53.65 | R23.2 120.94,60.99 U4.15 | U4.16 123.75,60.22 123.75,59.13 124.67,59.13 U4.1 | v110.81,62.87 110.81,67.27 U1.34 111.36,67.39 v112.08,66.67 | U6.7 89.43,58.84 v89.22,59.05 | v88.9,63.82 89.43,64.34 U6.18 | U1.44 102.21,66.67 | 102.21,66.67 v101.6,66.67 | 102.21,66.67 102.21,66.38 102.87,65.72 102.87,64.77 | 102.87,64.77 101.16,64.77 U1.2 | v104.46,60.64 103.82,60.64 | 103.82,60.64 101.29,60.64 U1.7 | 103.82,60.64 102.87,61.59 102.87,64.77
  Bottom 0.305: U3.3 91.32,51.09 | 91.32,51.09 92.71,49.7 C11.1 90.89,47.84 C9.1 | 91.32,51.09 92.54,51.09 92.96,51.51 92.96,52.43 92.37,53.02 U3.1 92.66,54.39 | 92.66,54.39 v92.66,57.91 | 92.66,54.39 93.44,54.39 v93.57,54.25 | v95.4,55.17 95.69,55.17 R1.2 98.09,55.18 C3.1 103.01,55.18 v104.55,53.65 | v105.46,57.61 106.95,59.1 | 106.95,59.1 107.95,60.1 F1.2 | v110.03,58.52 109.6,58.52 F1.2 | C13.1 104.14,70.3 C5.1 101.6,67.75 v101.6,66.67 | F1.2 108.11,60.17 v110.81,62.87 | v112.08,66.67 112.08,67.95 C1.1 | C2.1 112.01,55.5 v113.03,56.52 | v89.22,59.05 88.9,59.37 v88.9,63.82 | 106.95,59.1 105.73,60.33 105.73,60.64 v104.46,60.64
5V_UNFUSED  (via drill 0.51)
  Top 0.305: F2.1 135.62,70.27 R17.1 128.27,69 v128.27,68.9 | 111.76,71.12 111.76,70.8 v110.17,69.22 103.63,69.22 J2.2 100.97,72.63 102.23,73.9 102.23,76.52 101.28,77.47 D1.C | 111.76,71.12 D4.C | 111.76,71.12 112.71,70.17 v117.47,70.17
  Bottom 0.305: F1.1 107.95,63.5 110.17,65.72 v110.17,69.22 | v128.27,68.9 125.41,68.9 123.19,71.12 118.43,71.12 v117.47,70.17
+3.3V  (via drill 0.51)
  Top 0.305: LED2.A 61.99,60.58 U5.5P 63.87,60.59 v64.14,60.33 | v80.64,64.14 80.86,64.34 U6.31 | v81.28,58.42 81.7,58.84 U6.42 83.38,58.79 84.3,58.79 87.24,55.84 U6.1 90.67,50.43 v89.92,49.68
  Bottom 0.305: v64.14,60.33 66.25,60.33 C15.1 C14.1 R6.2 76.73,59.58 | 76.73,59.58 77.89,58.42 v81.28,58.42 | 76.73,59.58 76.73,60.22 v80.64,64.14 | L1.1 C12.1 | C12.1 85.81,47.84 C16.1 89.05,49.26 89.05,49.68 | C12.1 84.37,47.84 82.6,47.84 | 82.6,47.84 C17.1 | SW1.2 81.72,46.16 81.72,46.83 82.6,47.71 82.6,47.84 | 89.05,49.68 U3.4 | 89.05,49.68 v89.92,49.68
AREF  (via drill 0.51)
  Top 0.305: U1.42 104.53,65.01 105.09,64.45 106.36,64.45 106.68,64.77 v106.68,65.41
  Bottom 0.305: v106.68,65.41 106.68,69.53 107,69.85 107,71.1 C6.1
BUTTN_1  (via drill 0.51)
  Top 0.305: U1.26 112.95,60.22 113.62,60.22 114.37,60.96 117.79,60.96 v119.06,62.23 | v127.95,71.44 127.95,70.48 v125.41,67.94
  Bottom 0.305: J5.6 130.81,73.98 128.27,71.44 v127.95,71.44 | v125.41,67.94 119.7,62.23 v119.06,62.23
BUTTN_2
  Top 0.305: U1.27 112.95,61.02 113.62,61.02 114.2,61.59 116.84,61.59 119.7,64.45 119.7,67.94 123.19,71.44 J5.9
BUTTN_3  (via drill 0.51)
  Top 0.305: U1.28 112.95,61.81 113.62,61.81 114.04,62.23 116.2,62.23 v118.75,64.77 | v123.19,67.63 123.19,67.94 128.27,73.03 J5.7
  Bottom 0.305: v118.75,64.77 121.6,67.63 v123.19,67.63
BUTTN_4  (via drill 0.51)
  Top 0.305: U1.31 114.16,63.99 v114.3,64.14
  Bottom 0.305: v114.3,64.14 115.57,65.41 115.57,69.38 118.11,71.92 J5.11
CHARGER
  Top 0.305: C18.1 141.77,64.62 F2.2 138.11,64.3 U2.4
DATA_AVAILABLE_3V
  Top 0.305: U5.6P 73.38,58.59 76.5,55.47 81.53,55.47 82.35,56.29 83.27,56.29 U6.47
DATA_AVAILABLE_5V  (via drill 0.51)
  Top 0.305: 107.73,56.86 U1.18 107.73,52.92 v107.95,52.7 | U6.2 90.68,56.33 91.6,56.33 91.85,56.08 96.63,56.08 97.47,55.24 97.47,53.98 96.2,52.7 v96.2,52.39
  Bottom 0.305: v96.2,52.39 97.47,51.12 106.36,51.12 v107.95,52.7
DATA_N
  Top 0.305: R10.1 96.2,68.05 100.25,63.99 U1.3
DATA_P
  Top 0.305: U1.4 101.12,63.18 98.53,63.18 R11.1
DIO_4_R
  Bottom 0.305: R5.2 J5.8
DIO_5_R  (via drill 0.51)
  Top 0.305: v120.65,70.17 J5.10
  Bottom 0.305: R4.2 117.51,69.22 119.7,69.22 v120.65,70.17
DIO_6_R
  Top 0.305: J5.5 133.35,77.96 134.13,78.74 R3\.2
DIO_7_R
  Bottom 0.305: R2.2 J5.12
DIO_7_R1
  Bottom 0.305: R12.2 110.49,73.88 J5.14
DIO_7_R2
  Top 0.305: R17.2 130.67,73.1 133.27,73.1 135.89,75.72 J5.4
DIO_7_R3
  Top 0.305: R18.2 140.97,75.78 J5.2
ENABLE  (via drill 0.51)
  Top 0.305: R22.2 129.24,49.55 v129.24,58.22 | J5.3 133.86,71.63 v132.89,71.63 | v131.98,68.89 129.54,68.89 126.22,65.56 | U4.11 125.41,64.74 126.22,65.56 | v127,64.77 126.22,65.56
  Bottom 0.305: v131.98,68.89 131.98,70.71 v132.89,71.63 | v129.24,58.22 127.64,59.82 127.64,64.45 127.32,64.77 v127,64.77
GND  (79 unrouted)
H4
  Top 0.305: D4.A 111.76,74.93 J5.13
LBO  (via drill 0.51)
  Top 0.305: Q1.B 129.01,64.84 v128.02,65.84 | U4.12 124.75,66.45 v125.88,66.45
  Bottom 0.305: v125.88,66.45 127.41,66.45 v128.02,65.84
LED3
  Top 0.305: U1.25 114.33,59.2 LED3.A
LED4  (via drill 0.51)
  Top 0.305: LED4.A 108.79,46.35 v108.81,46.33 | v108.81,53.95 108.53,54.23 U1.19
  Bottom 0.305: v108.81,46.33 v108.81,53.95
LED_1  (via drill 0.51)
  Top 0.305: U1.29 112.95,62.62 113.62,62.62 113.87,62.87 115.57,62.87 v118.75,66.04 | v122.87,68.9 122.87,69.85 124.14,71.12 v124.14,71.44
  Bottom 0.305: v118.75,66.04 120.97,68.26 122.56,68.26 122.87,68.58 v122.87,68.9 | R5.1 125.73,71.44 v124.14,71.44
LED_2  (via drill 0.51)
  Top 0.305: U1.30 113.52,63.2 113.67,63.35 114.78,63.35 v115.57,64.14
  Bottom 0.305: v115.57,64.14 117.16,65.72 117.16,67.03 R4.1
LED_4  (via drill 0.51)
  Top 0.305: U1.32 113.69,64.8 v114.3,65.41
  Bottom 0.305: v114.3,65.41 114.3,70.27 R2.1
LED_5  (via drill 0.51)
  Top 0.305: U1.36 109.33,66.47 v108.27,65.41
  Bottom 0.305: v108.27,65.41 108.27,68.58 109.54,69.85 109.54,71.1 R12.1
LED_7  (via drill 0.51)
  Top 0.305: Q1.C 135,68.89 v135.64,68.89 | R18.1 138.43,71.07 v137.47,70.1
  Bottom 0.305: v135.64,68.89 136.85,70.1 v137.47,70.1
MCU_RST  (via drill 0.51)
  Top 0.305: C7.1 95.43,43.81 S1.2.1 S1.2.2 99.97,52.46 | 99.97,52.46 v99.97,53.34 99.97,54.97 v98.74,56.2 | U1.13 103.82,55.71 103.82,54.3 101.98,52.46 99.97,52.46 | J2.5 97.16,73.15 97.16,71.36 98.11,70.4 98.11,68.26 v97.79,67.94
  Bottom 0.305: R1.1 99.22,53.34 v99.97,53.34 | v97.79,67.94 94.61,64.77 94.61,57.47 95.57,56.52 98.42,56.52 v98.74,56.2
MISO_3V
  Top 0.305: U5.10P 81.97,56.59 82.2,56.83 83.31,56.83 U6.46
MISO_5V  (via drill 0.51)
  Top 0.305: U6.3 90.72,56.9 92.76,56.9 93.46,57.59 U1.11 | U1.11 101.15,57.61 | J2.1 99.69,73.15 v99.69,67.94 | v100.33,56.52 101.13,57.32 U1.11
  Bottom 0.305: v99.69,67.94 100.01,67.63 100.01,56.83 v100.33,56.52
MOSI_3V
  Top 0.203: U5.11P 81.45,61.84 U6.36
MOSI_5V  (via drill 0.51)
  Top 0.305: U1.10 95.94,58.4 92.49,61.84 U6.13 87.06,61.84 86.68,62.23 v86.68,68.58
  Bottom 0.305: v86.68,68.58 87.31,69.22 97.79,69.22 98.42,69.85 J2.4
N$1
  Bottom 0.305: L1.2 88.61,53.47 U3.5
N$2  (via drill 0.51)
  Top 0.305: LED3.C 116.43,59.58 v116.43,58.52
  Bottom 0.305: v116.43,58.52 117.36,58.52 R9.2
N$3
  Top 0.305: R7.2 114.3,51.73 LED1.C
N$4
  Top 0.203: R8.2 LED2.C
N$5
  Top 0.305: R10.2 89.7,76.25 J3.2
N$6
  Top 0.305: R14.2 LED4.C
N$7
  Top 0.305: D1.A 94.28,76.2 91.76,76.2 90.5,77.46 J3.1
N$8
  Top 0.305: U2.1 R15.2
N$10
  Top 0.305: R16.1 134.33,62.26 U2.5
N$11
  Top 0.305: R11.2 J3.3
N$12
  Top 0.305: R15.1 LED6.A
N$13  (1 unrouted)
  Top 0.305: L2.P$2 124.13,56.5 126.06,58.43 U4.3
N$14  (via drill 0.51)
  Top 0.305: R26.1 133.67,51.44 R25.2 130.76,54.98 v130.76,58.83 | v128.59,64.14 127.87,63.42 U4.9
  Bottom 0.305: v130.76,58.83 129.22,60.36 129.22,63.82 128.91,64.14 v128.59,64.14
N$16
  Top 0.305: U4.14 122.19,61.64 R23.1 120.65,65.72 R24.2
RADIO_RST_3V
  Top 0.203: 78.38,64.77 U5.14P 78.35,64.74
  Top 0.305: U5.14P 78.53,64.92 81.61,64.92 81.68,64.84 U6.30
RADIO_RST_5V  (via drill 0.51)
  Top 0.305: v105.41,65.72 105.41,67.32 U1.41 105.43,67.49 105.43,68.28 105.24,68.47 103.69,68.47 103.27,68.9 101.92,68.9 99.69,66.67 v98.74,66.67 | U6.19 95.49,64.84 v96.84,63.5
  Bottom 0.305: v96.84,63.5 96.84,64.77 v98.74,66.67
RF_SIGNAL
  Top 0.203: J4.1 61.99,68.58 U5.1P
SCK_3V
  Top 0.203: U6.35 83.22,62.24 79.83,62.24 78.2,60.61 U5.12P
SCK_5V  (via drill 0.51)
  Top 0.305: U1.9 100.91,58.98 100.25,58.98 100.15,58.88 96.27,58.88 92.8,62.34 U6.14 87.83,62.34 87.63,62.55 v87.63,71.12
  Bottom 0.305: v87.63,71.12 87.63,74.3 89.22,75.88 98.11,75.88 98.42,75.56 J2.3
SHIFTER_EN  (via drill 0.51)  (1 unrouted)
  Top 0.305: 83.33,55.81 83.33,55.38 SW1.1 R13.2 | U6.48 84.5,55.84 v85.04,56.39 | U6.25 84.44,67.34 v85.04,66.75
  Bottom 0.305: v85.04,66.75 v85.04,56.39
SS_3V  (via drill 0.51)
  Top 0.203: 79.11,62.59 U5.13P 78.95,63.34 U6.33
  Top 0.305: v76.5,62.79 76.7,62.59 U5.13P
  Bottom 0.305: R6.1 76.21,63.08 v76.5,62.79
SS_5V
  Top 0.305: U1.8 96.22,59.99 96.2,60.01 92.86,63.34 U6.16
UCAP
  Top 0.305: C4.1 U1.6
VBAT
  Top 0.305: R22.1 L2.P$1 127.33,57.8 129.54,60.01 129.54,61.59 128.84,62.29 U4.8 128.74,63.2 132.66,63.2 134.25,64.79 | 134.25,64.79 Q1.E | B1.2 145.86,59.66 U2.3 138.11,60.92 137.12,61.91 137.12,63 136.01,64.11 134.93,64.11 134.25,64.79 | C21.1 C19.1 R22.1 | R22.1 R26.2
XTAL1
  Top 0.305: C8.1 110.24,49.7 X1.1 106.93,50.8 U1.17
XTAL2
  Top 0.305: X1.3 104.77,48.09 C10.1 103.97,49.92 106.22,52.16 106.22,55.71 U1.16
(copper drawn outside any net)
  shapes: Top area x1